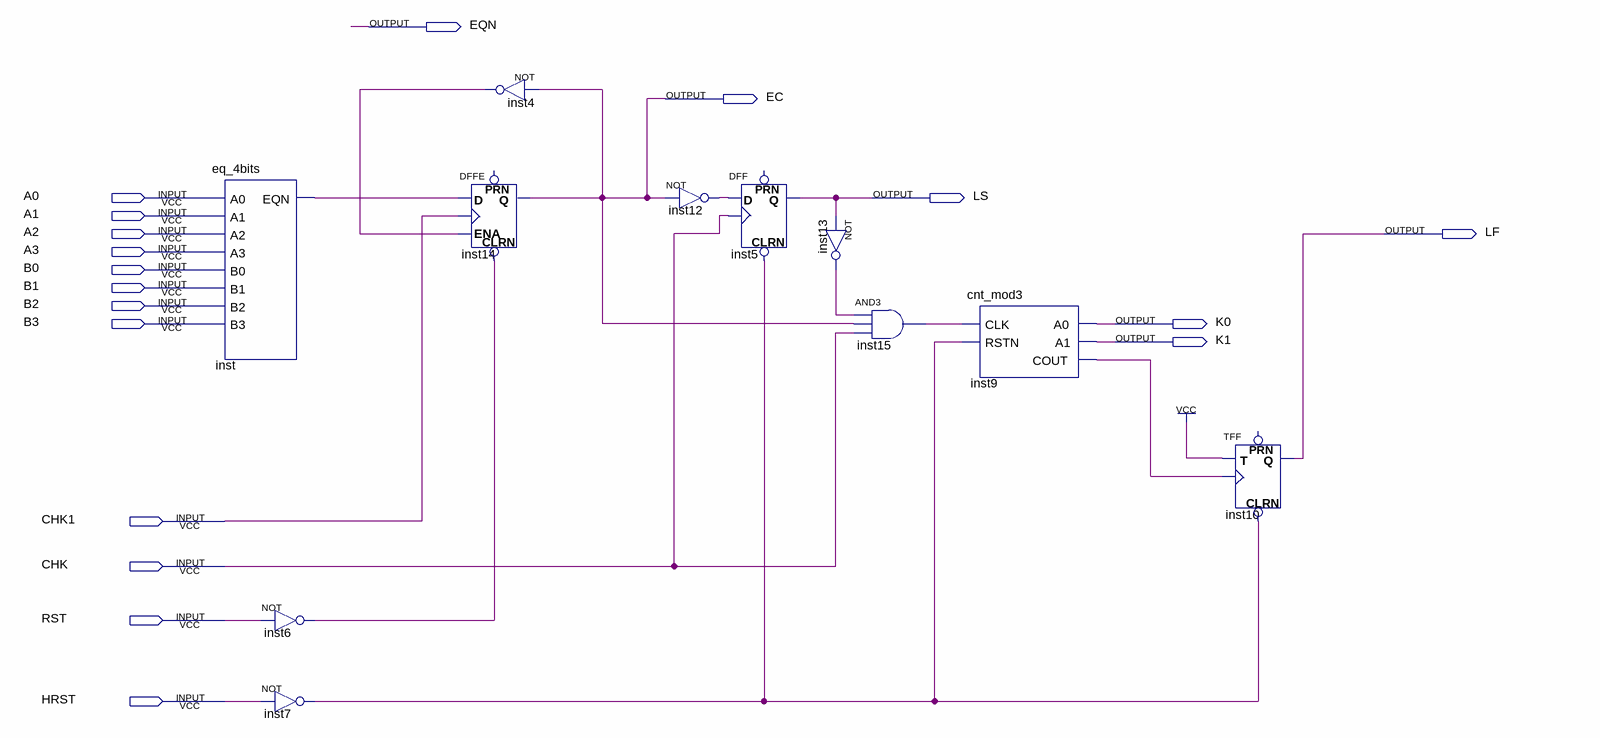
[diagram p0: schematic sheet]
// Quartus schematic eq_ch_temp.bdf as structural Verilog: 11 symbols, 18 pins
module eq_ch_temp (
  input  A0,
  input  A1,
  input  A2,
  input  A3,
  input  B0,
  input  B1,
  input  B2,
  input  B3,
  input  CHK1,
  input  CHK,
  input  RST,
  input  HRST,
  output EQN,
  output EC,
  output LS,
  output LF,
  output K0,
  output K1
);

  wire inst4_out, inst6_out, inst7_out, inst9_cout, inst12_out, inst13_out, inst15_out, inst_eqn;

  eq_4bits inst (.A0(A0), .A1(A1), .A2(A2), .A3(A3), .B0(B0), .B1(B1), .B2(B2), .B3(B3), .EQN(inst_eqn));
  not inst6 (inst6_out, RST);
  not inst7 (inst7_out, HRST);
  not inst4 (inst4_out, EC);
  DFFE inst14 (.CLRN(inst6_out), .D(inst_eqn), .CLK(CHK1), .ENA(inst4_out), .Q(EC));  // open: PRN
  DFF inst5 (.CLRN(inst7_out), .CLK(CHK), .D(inst12_out), .Q(LS));  // open: PRN
  not inst12 (inst12_out, EC);
  not inst13 (inst13_out, LS);
  and inst15 (inst15_out, inst13_out, EC, CHK);
  cnt_mod3 inst9 (.CLK(inst15_out), .RSTN(inst7_out), .A0(K0), .A1(K1), .COUT(inst9_cout));
  TFF inst10 (.CLRN(inst7_out), .T(1'b1), .CLK(inst9_cout), .Q(LF));  // open: PRN
endmodule
